# EAGLE design STM32F107RC.ETH (EAGLE 7.1.0)
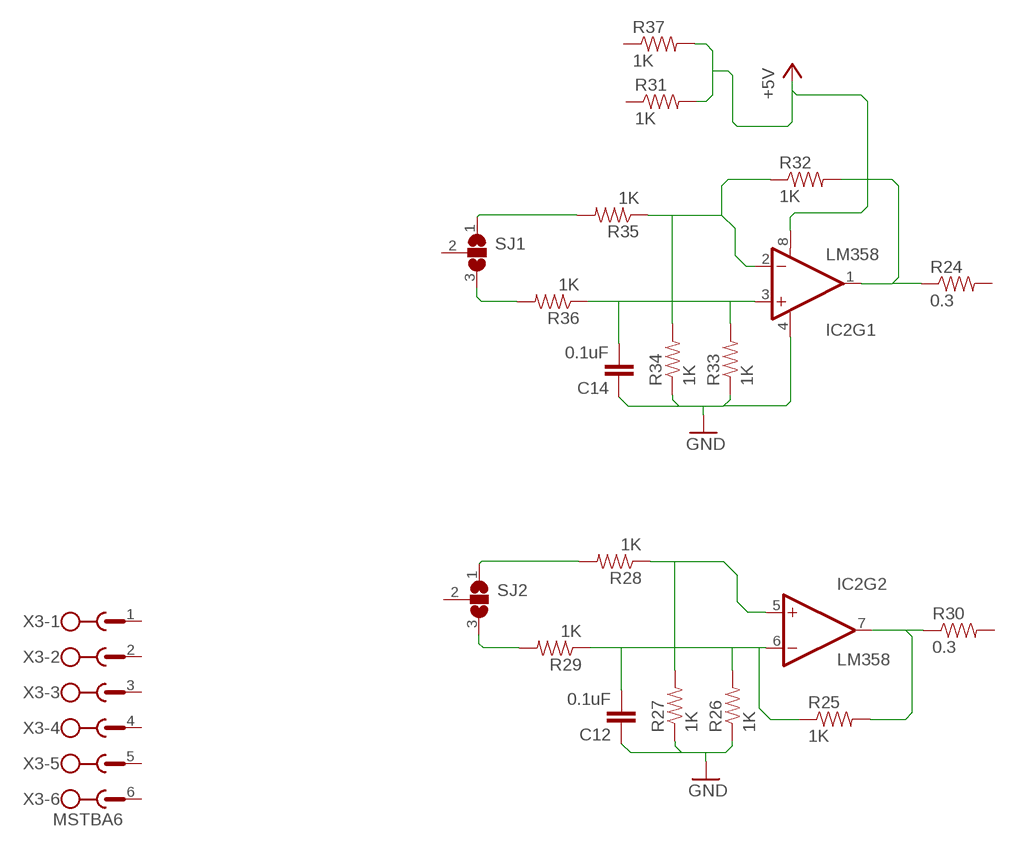
[diagram p0: schematic, sheet 1, part 1 of 2]
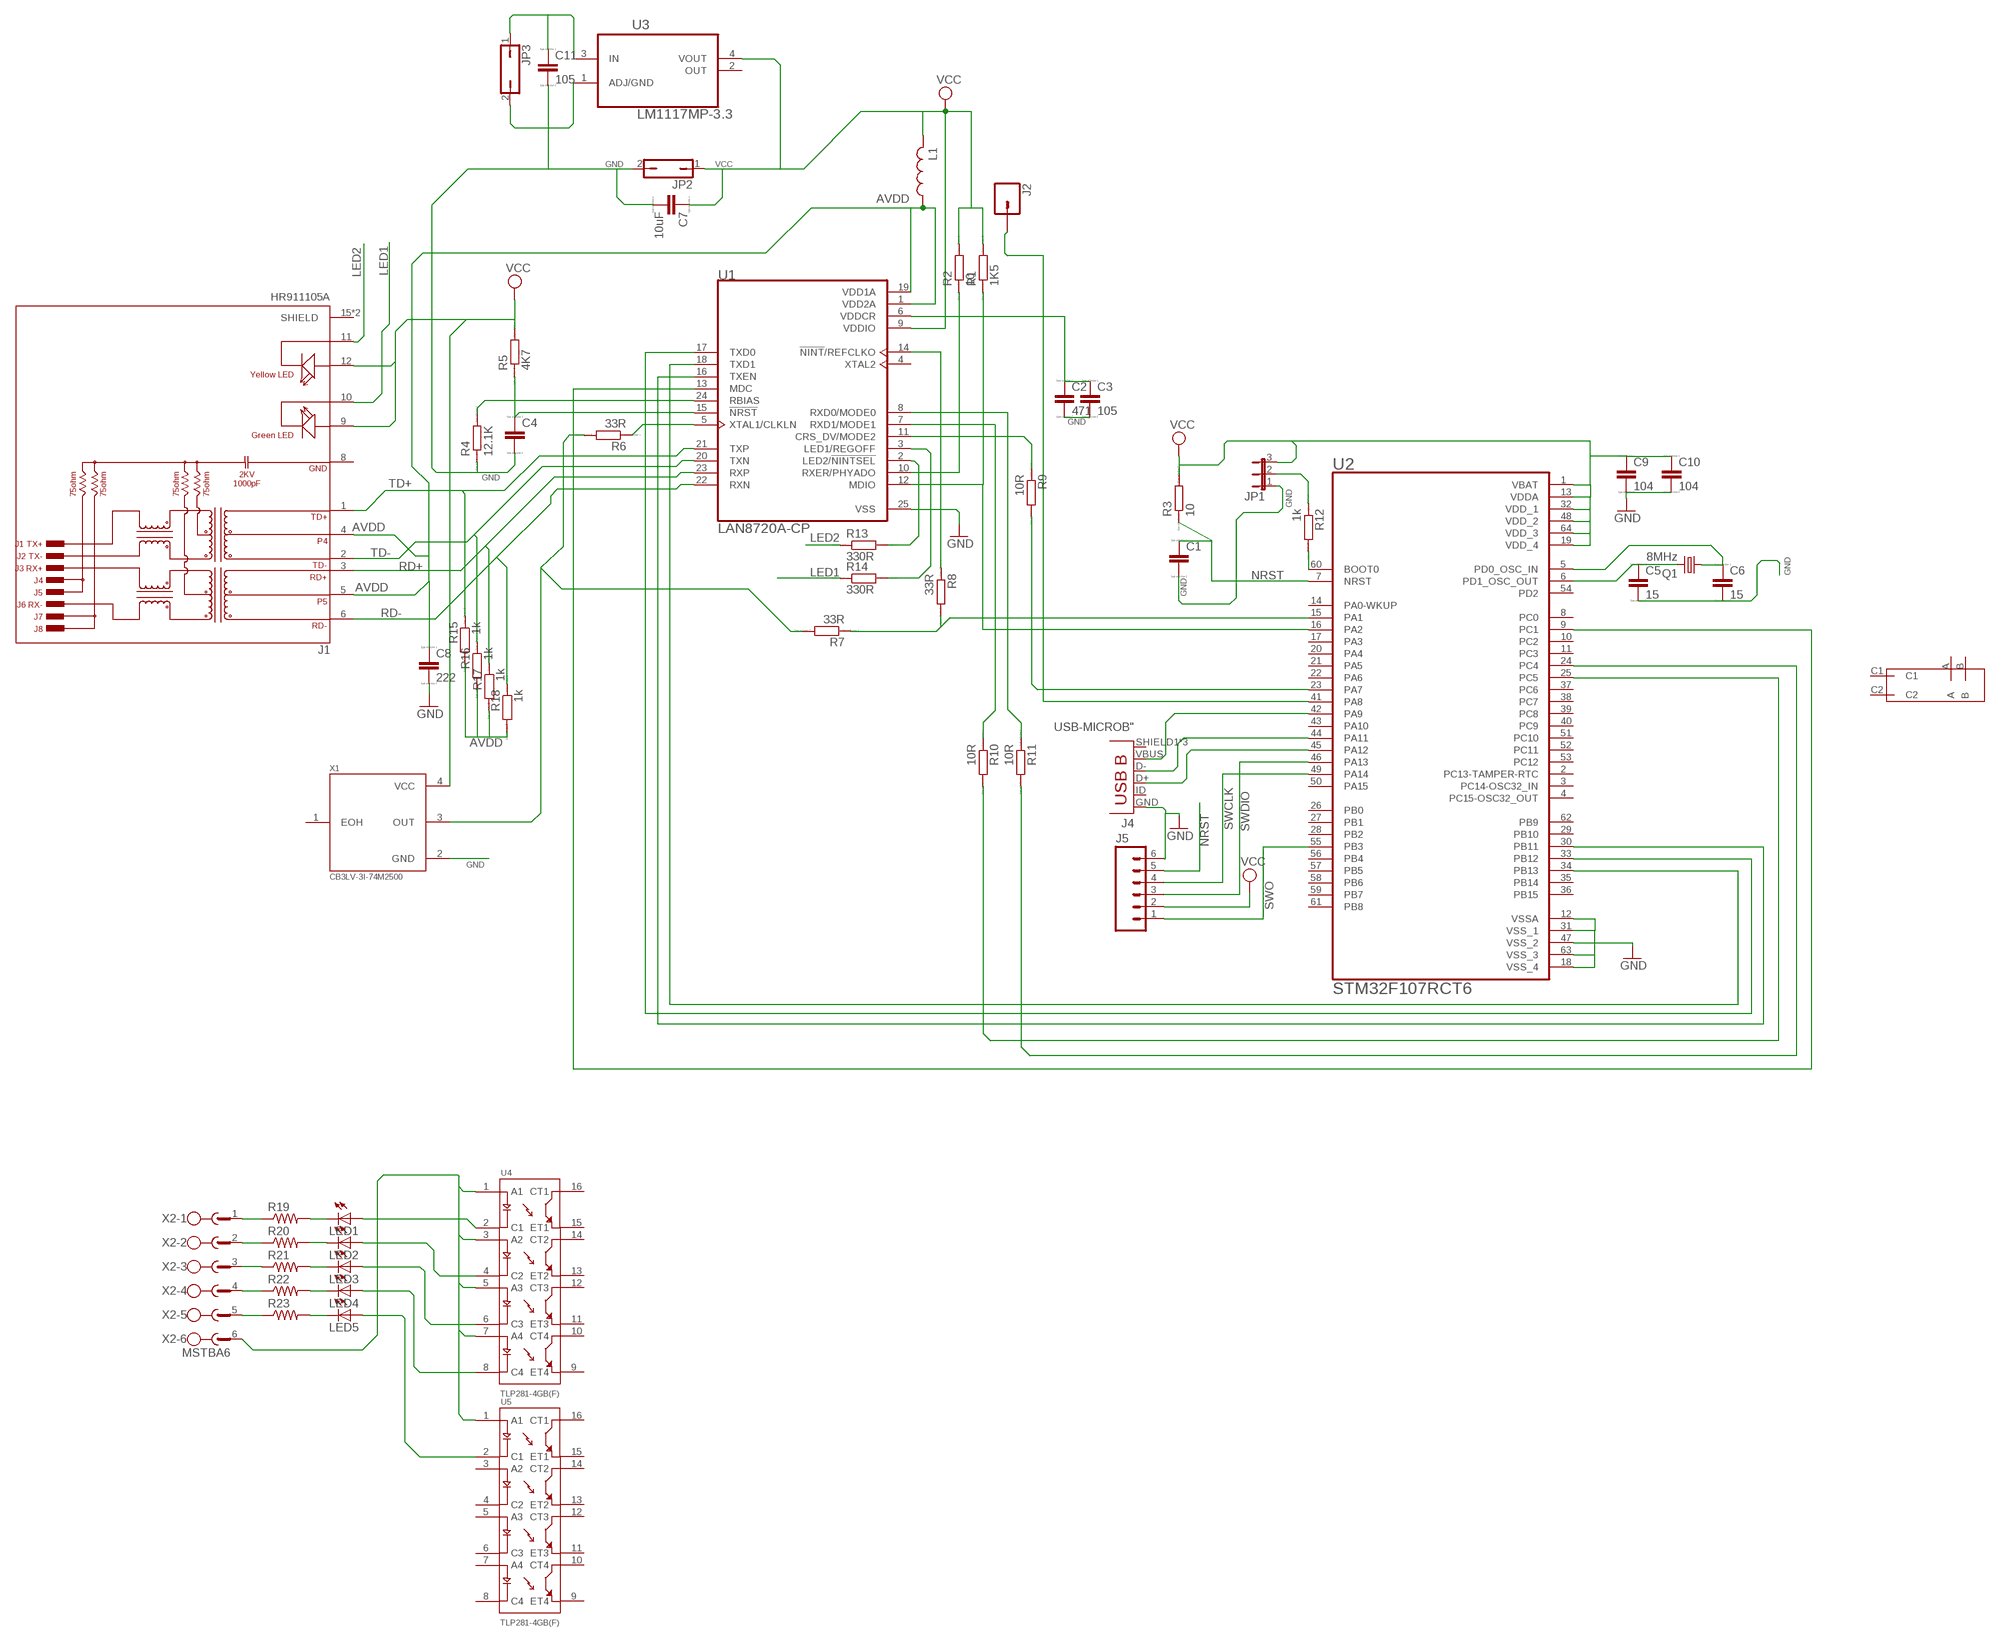
[diagram p1: schematic, sheet 1, part 2 of 2]

## Parts
C1  C-EUC1206  [C1206]
C2  471  C-EUC1206  [C1206]
C3  105  C-EUC1206  [C1206]
C4  C-EUC1206  [C1206]
C5  15  C-EUC1206  [C1206]
C6  15  C-EUC1206  [C1206]
C7  10uF  C-EUC1206  [C1206]
C8  222  C-EUC1206  [C1206]
C9  104  C-EUC1206  [C1206]
C10  104  C-EUC1206  [C1206]
C11  105  C-EUC1206  [C1206]
C12  0.1uF  0.1UF-25V-5%(0603)  [0603-CAP]
C14  0.1uF  0.1UF-25V-5%(0603)  [0603-CAP]
IC2  LM358  [LM358_DIP08]
J1  HR911105A  [HANRUN_HR911105A]
J2  M01OFFSET  [1X01_OFFSET]
J4  USB-MICROB"  [USB-B-MICRO-SMD_V03]
J5  M06POLAR  [MOLEX-1X6]
JP1  JP2E  [JP2]
JP2  JP1Q  [JP1]
JP3  JP1Q  [JP1]
L1  L-US0207/7  [0207/7]
LED1  LEDCHIPLED_0805  [CHIPLED_0805]
LED2  LEDCHIPLED_0805  [CHIPLED_0805]
LED3  LEDCHIPLED_0805  [CHIPLED_0805]
LED4  LEDCHIPLED_0805  [CHIPLED_0805]
LED5  LEDCHIPLED_0805  [CHIPLED_0805]
Q1  8MHz  CRYSTALHC49S  [HC49/S]
R1  1K5  R-EU_0204_7  [0204/7]
R2  10  R-EU_0204_7  [0204/7]
R3  10  R-EU_0204_7  [0204/7]
R4  12.1K  R-EU_0204_7  [0204/7]
R5  4K7  R-EU_0204_7  [0204/7]
R6  33R  R-EU_0204_7  [0204/7]
R7  33R  R-EU_0204_7  [0204/7]
R8  33R  R-EU_0204_7  [0204/7]
R9  10R  R-EU_0204_7  [0204/7]
R10  10R  R-EU_0204_7  [0204/7]
R11  10R  R-EU_0204_7  [0204/7]
R12  1k  R-EU_0204_7  [0204/7]
R13  330R  R-EU_0204_7  [0204/7]
R14  330R  R-EU_0204_7  [0204/7]
R15  1k  R-EU_0204_7  [0204/7]
R16  1k  R-EU_0204_7  [0204/7]
R17  1k  R-EU_0204_7  [0204/7]
R18  1k  R-EU_0204_7  [0204/7]
R19  RESISTOR0805-RES  [0805]
R20  RESISTOR0805-RES  [0805]
R21  RESISTOR0805-RES  [0805]
R22  RESISTOR0805-RES  [0805]
R23  RESISTOR0805-RES  [0805]
R24  0.3  0.3OHM-1/8W-1%(0805)  [0805]
R25  1K  1KOHM-1/4W-1%(PTH)  [AXIAL-0.3]
R26  1K  1KOHM-1/4W-1%(PTH)  [AXIAL-0.3]
R27  1K  1KOHM-1/4W-1%(PTH)  [AXIAL-0.3]
R28  1K  1KOHM-1/4W-1%(PTH)  [AXIAL-0.3]
R29  1K  1KOHM-1/4W-1%(PTH)  [AXIAL-0.3]
R30  0.3  0.3OHM-1/8W-1%(0805)  [0805]
R31  1K  1KOHM-1/4W-1%(PTH)  [AXIAL-0.3]
R32  1K  1KOHM-1/4W-1%(PTH)  [AXIAL-0.3]
R33  1K  1KOHM-1/4W-1%(PTH)  [AXIAL-0.3]
R34  1K  1KOHM-1/4W-1%(PTH)  [AXIAL-0.3]
R35  1K  1KOHM-1/4W-1%(PTH)  [AXIAL-0.3]
R36  1K  1KOHM-1/4W-1%(PTH)  [AXIAL-0.3]
R37  1K  1KOHM-1/4W-1%(PTH)  [AXIAL-0.3]
SJ1  SJ2W  [SJ_2]
SJ2  SJ2W  [SJ_2]
U1  LAN8720A-CP  [QFN50P400X400X100-25N]
U2  STM32F107RCT6  [QFP50P1200X1200X160-64N]
U3  LM1117MP-3.3  [SOT230P696X180-4N]
U4  TLP281-4GB(F)  [SOIC127P700X210-16N]
U5  TLP281-4GB(F)  [SOIC127P700X210-16N]
U$1  OMRON-RELAY-G5NB  [OMRON-G5NB]
X1  CB3LV-3I-74M2500  [OSCCC700X500X180-4N]
X2  MSTBA6  [MSTBA6]
X3  MSTBA6  [MSTBA6]

## Nets
+5V: IC2.8(V+) R31.P$2 R37.P$2
AVDD: C8.1 J1.4 J1.5 L1.1 R15.2 R16.2 R17.2 R18.2 U1.1(VDD2A) U1.19(VDD1A)
GND: C1.2 C2.2 C3.2 C4.2 C5.2 C6.2 C7.2 C8.2 C9.2 C10.2 C11.2 C12.1 C14.1 IC2.4(V-) J4.GND J5.6 JP1.1 JP2.2 JP3.2 R4.1 R26.P$1 R27.P$1 R33.P$1 R34.P$1 U1.25(VSS) U2.12(VSSA) U2.18(VSS_4) U2.31(VSS_1) U2.47(VSS_2) U2.63(VSS_3) U3.1(ADJ/GND) X1.2(GND)
LED1: J1.10(GC) R14.1
LED2: J1.11(YC) R13.1
N$1: R1.1 U1.12(MDIO) U2.16(PA2)
N$2: U1.13(MDC) U2.9(PC1)
N$3: R7.1 R8.2 U2.15(PA1)
N$4: R9.2 U2.23(PA7)
N$5: R11.2 U2.24(PC4)
N$6: J4.VBUS U2.42(PA9)
N$7: U1.16(TXEN) U2.30(PB11)
N$8: U1.17(TXD0) U2.33(PB12)
N$9: U1.18(TXD1) U2.34(PB13)
N$10: J2.1 U2.41(PA8)
N$11: J4.D- U2.44(PA11)
N$12: R2.1 U1.10(RXER/PHYADO)
N$13: R4.2 U1.24(RBIAS)
N$14: C2.1 C3.1 U1.6(VDDCR)
N$15: R10.2 U2.25(PC5)
N$16: C4.1 R5.1 U1.15(!NRST)
N$17: R6.1 U1.5(XTAL1/CLKLN)
N$18: R6.2 R7.2 X1.3(OUT)
N$19: R8.1 U1.14(!NINT!/REFCLKO)
N$20: R9.1 U1.11(CRS_DV/MODE2)
N$21: R10.1 U1.7(RXD1/MODE1)
N$22: R11.1 U1.8(RXD0/MODE0)
N$23: C11.1 JP3.1 U3.3(IN)
N$24: JP1.2 R12.1
N$25: R12.2 U2.60(BOOT0)
N$26: C6.1 Q1.1 U2.5(PD0_OSC_IN)
N$27: C5.1 Q1.2 U2.6(PD1_OSC_OUT)
N$28: J4.D+ U2.45(PA12)
N$29: R19.1 X2.1
N$30: R20.1 X2.2
N$31: R21.1 X2.3
N$32: LED1.C R19.2
N$33: LED2.C R20.2
N$34: LED3.C R21.2
N$35: LED1.A U4.2(C1)
N$36: LED2.A U4.4(C2)
N$37: LED3.A U4.6(C3)
N$38: U4.1(A1) U4.3(A2) U4.5(A3) U4.7(A4) U5.1(A1) X2.6
N$39: R22.1 X2.4
N$40: LED4.C R22.2
N$41: LED4.A U4.8(C4)
N$44: C12.2 IC2.6(-IN) R25.P$1 R26.P$2 R29.P$1
N$45: R23.1 X2.5
N$46: LED5.C R23.2
N$47: LED5.A U5.2(C1)
N$48: IC2.5(+IN) R27.P$2 R28.P$1
N$49: IC2.7(OUT) R25.P$2 R30.1
N$50: R28.P$2 SJ2.1
N$51: R29.P$2 SJ2.3
N$55: IC2.2(-IN) R32.P$1 R34.P$2 R35.P$1
N$56: C14.2 IC2.3(+IN) R33.P$2 R36.P$1
N$58: IC2.1(OUT) R24.1 R32.P$2
N$60: R35.P$2 SJ1.1
N$61: R36.P$2 SJ1.3
NRST: C1.1 J5.5 R3.1 U2.7(NRST)
RD+: J1.3(RD+) R17.1 U1.23(RXP)
RD-: J1.6(RD-) R18.1 U1.22(RXN)
SIG_LED01: R14.2 U1.3(LED1/REGOFF)
SIG_LED02: R13.2 U1.2(LED2/!NINTSEL!)
SWCLK: J5.4 U2.49(PA14)
SWDIO: J5.3 U2.46(PA13)
SWO: J5.1 U2.55(PB3)
TD+: J1.1(TD+) R15.1 U1.21(TXP)
TD-: J1.2(TD-) R16.1 U1.20(TXN)
VCC: C7.1 C9.1 C10.1 J1.9(GA) J1.12(YA) J5.2 JP1.3 JP2.1 L1.2 R1.2 R2.2 R3.2 R5.2 U1.9(VDDIO) U2.1(VBAT) U2.13(VDDA) U2.19(VDD_4) U2.32(VDD_1) U2.48(VDD_2) U2.64(VDD_3) U3.4(VOUT) X1.4(VCC)
Unconnected: J1.15(SHIELD) J1.16(SHIELD) J4.ID(USBID) J4.SHIELD1(SHIELD) J4.SHIELD2(SHIELD) J4.SHIELD3(SHIELD) R24.2 R30.2 R31.P$1 R37.P$1 SJ1.2 SJ2.2 U1.4(XTAL2) U2.2(PC13-TAMPER-RTC) U2.3(PC14-OSC32_IN) U2.4(PC15-OSC32_OUT) U2.8(PC0) U2.10(PC2) U2.11(PC3) U2.14(PA0-WKUP) U2.17(PA3) U2.20(PA4) U2.21(PA5) U2.22(PA6) U2.26(PB0) U2.27(PB1) U2.28(PB2) U2.29(PB10) U2.35(PB14) U2.36(PB15) U2.37(PC6) U2.38(PC7) U2.39(PC8) U2.40(PC9) U2.43(PA10) U2.50(PA15) U2.51(PC10) U2.52(PC11) U2.53(PC12) U2.54(PD2) U2.56(PB4) U2.57(PB5) U2.58(PB6) U2.59(PB7) U2.61(PB8) U2.62(PB9) U3.2(OUT) U4.9(ET4) U4.10(CT4) U4.11(ET3) U4.12(CT3) U4.13(ET2) U4.14(CT2) U4.15(ET1) U4.16(CT1) U5.3(A2) U5.4(C2) U5.5(A3) U5.6(C3) U5.7(A4) U5.8(C4) U5.9(ET4) U5.10(CT4) U5.11(ET3) U5.12(CT3) U5.13(ET2) U5.14(CT2) U5.15(ET1) U5.16(CT1) U$1.A U$1.B U$1.C1 U$1.C2 X1.1(EOH) X3.1 X3.2 X3.3 X3.4 X3.5 X3.6

## Power pins joined to a net without a drawn wire
GND: J1.8(GND)

## Library data of the parts
C1-C11 = resistor:C-EU: CAPACITOR, European symbol; SPICEPREFIX: C
C12 C14 = SparkFun-Capacitors:0.1UF-25V-5%(0603): CAP-08604; PROD_ID: CAP-08604
IC2 = SparkFun-AnalogIC:LM358: Jellybean op-amp
J1 = HR911105A:HR911105A: DIP RJ45 Connector;; AVAILABILITY: Unavailable; DESCRIPTION: DIP RJ45 Connector;; MF: HanRun; MP: HR911105A; PACKAGE: None; PRICE: None
J2 = SparkFun-Connectors:M01: Header 1 Standard 1-pin 0.1" header. Use with straight break away headers (SKU : PRT-00116), right angle break away headers (PRT-00553), swiss pins (PRT-00743), machine pins (PRT-00117), and female headers (PRT-00115). SMTSO-256-ET is a "flush mount" nut for a 4-40 screw. The older package used to be too tight, and did not allow it to sit properly thru the drill hit. The latest (0.165DIA) fits nice and snug.
J4 = SparkFun-Connectors:USB-MICROB: RED_PASTE version has 70% paste area under D+ D- USBID pins for applications where those pins aren't required, to reduce the likelihood of bridges.; PROD_ID: CONN-11752
J5 = SparkFun-Connectors:M06: Header 6 Standard 6-pin 0.1" header. Use with straight break away headers (SKU : PRT-00116), right angle break away headers (PRT-00553), swiss pins (PRT-00743), machine pins (PRT-00117), and female headers (PRT-00115). Molex polarized connector foot print use with SKU : PRT-08094 with associated crimp pins and housings. NOTES ON THE VARIANTS LOCK and LOCK_LONGPADS... This footprint was designed to help hold the alignment of a through-hole component (i.e. 6-pin header) while soldering it into place. You may notice that each hole has been shifted either up or down by 0.005 of an inch from it's more standard position (which is a perfectly straight line). This slight alteration caused the pins (the squares in the middle) to touch the edges of the holes. Because they are alternating, it causes a "brace" to hold the component in place. 0.005 has proven to be the perfect amount of "off-center" position when using our standard breakaway headers. Although looks a little odd when you look at the bare footprint, once you have a header in there, the alteration is very hard to notice. Also,if you push a header all the way into place, it is covered up entirely on the bottom side. This idea of altering the position of holes to aid alignment will be further integrated into the Sparkfun Library for other footprints. It can help hold any component with 3 or more connection pins.
JP1 = jumper:JP2E: JUMPER
JP2 JP3 = jumper:JP1Q: JUMPER
L1 = resistor:L-US: INDUCTOR, American symbol
LED1-LED5 = led:LED: LED OSRAM: - CHIPLED LG R971, LG N971, LY N971, LG Q971, LY Q971, LO R971, LY R971 LH N974, LH R974 LS Q976, LO Q976, LY Q976 LO Q996 - Hyper CHIPLED LW Q18S LB Q993, LB Q99A, LB R99A - SideLED LS A670, LO A670, LY A670, LG A670, LP A670 LB A673, LV A673, LT A673, LW A673 LH A674 LY A675 LS A676, LA A676, LO A676, LY A676, LW A676 LS A679, LY A679, LG A679 - Hyper Micro SIDELED® LS Y876, LA Y876, LO Y876, LY Y876 LT Y87S - SmartLED LW L88C, LW L88S LB L89C, LB L89S, LG L890 LS L89K, LO L89K, LY L89K LS L896, LA L896, LO L896, LY L896 - TOPLED LS T670, LO T670, LY T670, LG T670, LP T670 LSG T670, LSP T670, LSY T670, LOP T670, LYG T670 LG T671, LOG T671, LSG T671 LB T673, LV T673, LT T673, LW T673 LH T674 LS T676, LA T676, LO T676, LY T676, LB T676, LH T676, LSB T676, LW T676 LB T67C, LV T67C, LT T67C, LS T67K, LO T67K, LY T67K, LW E67C LS E67B, LA E67B, LO E67B, LY E67B, LB E67C, LV E67C, LT E67C LW T67C LS T679, LY T679, LG T679 LS T770, LO T770, LY T770, LG T770, LP T770 LB T773, LV T773, LT T773, LW T773 LH T774 LS E675, LA E675, LY E675, LS T675 LS T776, LA T776, LO T776, LY T776, LB T776 LHGB T686 LT T68C, LB T68C - Hyper Mini TOPLED® LB M676 - Mini TOPLED Santana® LG M470 LS M47K, LO M47K, LY M47K Source: http://www.osram.convergy.de LUXEON: - LUMILED® LXK2-PW12-R00, LXK2-PW12-S00, LXK2-PW14-U00, LXK2-PW14-V00 LXK2-PM12-R00, LXK2-PM12-S00, LXK2-PM14-U00 LXK2-PE12-Q00, LXK2-PE12-R00, LXK2-PE12-S00, LXK2-PE14-T00, LXK2-PE14-U00 LXK2-PB12-K00, LXK2-PB12-L00, LXK2-PB12-M00, LXK2-PB14-N00, LXK2-PB14-P00, LXK2-PB14-Q00 LXK2-PR12-L00, LXK2-PR12-M00, LXK2-PR14-Q00, LXK2-PR14-R00 LXK2-PD12-Q00, LXK2-PD12-R00, LXK2-PD12-S00 LXK2-PH12-R00, LXK2-PH12-S00 LXK2-PL12-P00, LXK2-PL12-Q00, LXK2-PL12-R00 Source: www.luxeon.com KINGBRIGHT: KA-3528ASYC Source: www.kingbright.com
Q1 = crystal:CRYSTAL: CRYSTAL; OC_FARNELL: 1667008; OC_NEWARK: unknown
R1-R18 = resistor:R-EU_: RESISTOR, European symbol; SPICEPREFIX: R
R19-R23 = SparkFun-Resistors:RESISTOR: Resistor Basic schematic elements and footprints for 0603, 1206, and PTH resistors.
R24 R30 = SparkFun-Resistors:0.3OHM-1/8W-1%(0805): RES-11622; PROD_ID: RES-11622
R25-R29 R31-R37 = SparkFun-Resistors:1KOHM-1/4W-1%(PTH): RES-12182; PROD_ID: RES-12182
SJ1 SJ2 = jumper:SJ2W: SMD solder JUMPER
U1 = LAN8720A-CP:LAN8720A-CP: LAN8720A Series 3.3 V RMII 10/100 Ethernet Transceiver Surface Mount - QFN-24; AVAILABILITY: Unavailable; DESCRIPTION: LAN8720A Series 3.3 V RMII 10/100 Ethernet Transceiver Surface Mount - QFN-24; MF: Microchip; MP: LAN8720A-CP; PACKAGE: QFN-24 Microchip; PRICE: None
U2 = STM32F107RCT6:STM32F107RCT6: ARM-based 32-bit MCU; AVAILABILITY: Unavailable; DESCRIPTION: MCU 32-bit STM32F1 ARM Cortex M3 RISC 256KB Flash 2.5V/3.3V 64-Pin LQFP Tray; MF: STMicroelectronics; MP: STM32F107RCT6; PACKAGE: LQFP-64 STMicroelectronics; PRICE: None
U3 = LM1117MP-3.3:LM1117MP-3.3: Linear regulators; AVAILABILITY: Unavailable; DESCRIPTION: LDO Regulator Pos 3.3V 0.8A 4-Pin_3+Tab_ SOT-223 T/R; MF: Texas Instruments; MP: LM1117MP-3.3; PACKAGE: SOT-223 Texas Instruments; PRICE: None
U4 U5 = TLP281-4GB_F_:TLP281-4GB(F): Optocoupler DC-IN 4-CH Transistor DC-OUT 16-Pin SOP; AVAILABILITY: Unavailable; DESCRIPTION: Optocoupler DC-IN 4-CH Transistor DC-OUT 16-Pin SOP; MF: Toshiba; MP: TLP281-4GB_F_; PACKAGE: SOP-16 Toshiba; PRICE: None
U$1 = omron-G5NB-1A-E:OMRON-RELAY-G5NB
X1 = CB3LV-3I-74M2500:CB3LV-3I-74M2500: Oscillator XO 50MHz 50ppm 50pF HCMOS/TTL 55% 3.3V 4-Pin SMD T/R; AVAILABILITY: Unavailable; DESCRIPTION: CB3LV Series 74.25 MHz 7 x 5 mm 3.3 V ±50 ppm SMT HCMOS/TTL Clock Oscillator; MF: CTS-Frequency; MP: CB3LV-3I-74M2500; PACKAGE: SMD-4 CTS Components; PRICE: None
X2 X3 = con-phoenix-508:MSTBA6: PHOENIX; MF: FARNELL; MPN: 1757284; OC_FARNELL: 3705213; OC_NEWARK: 71C4165

## Board
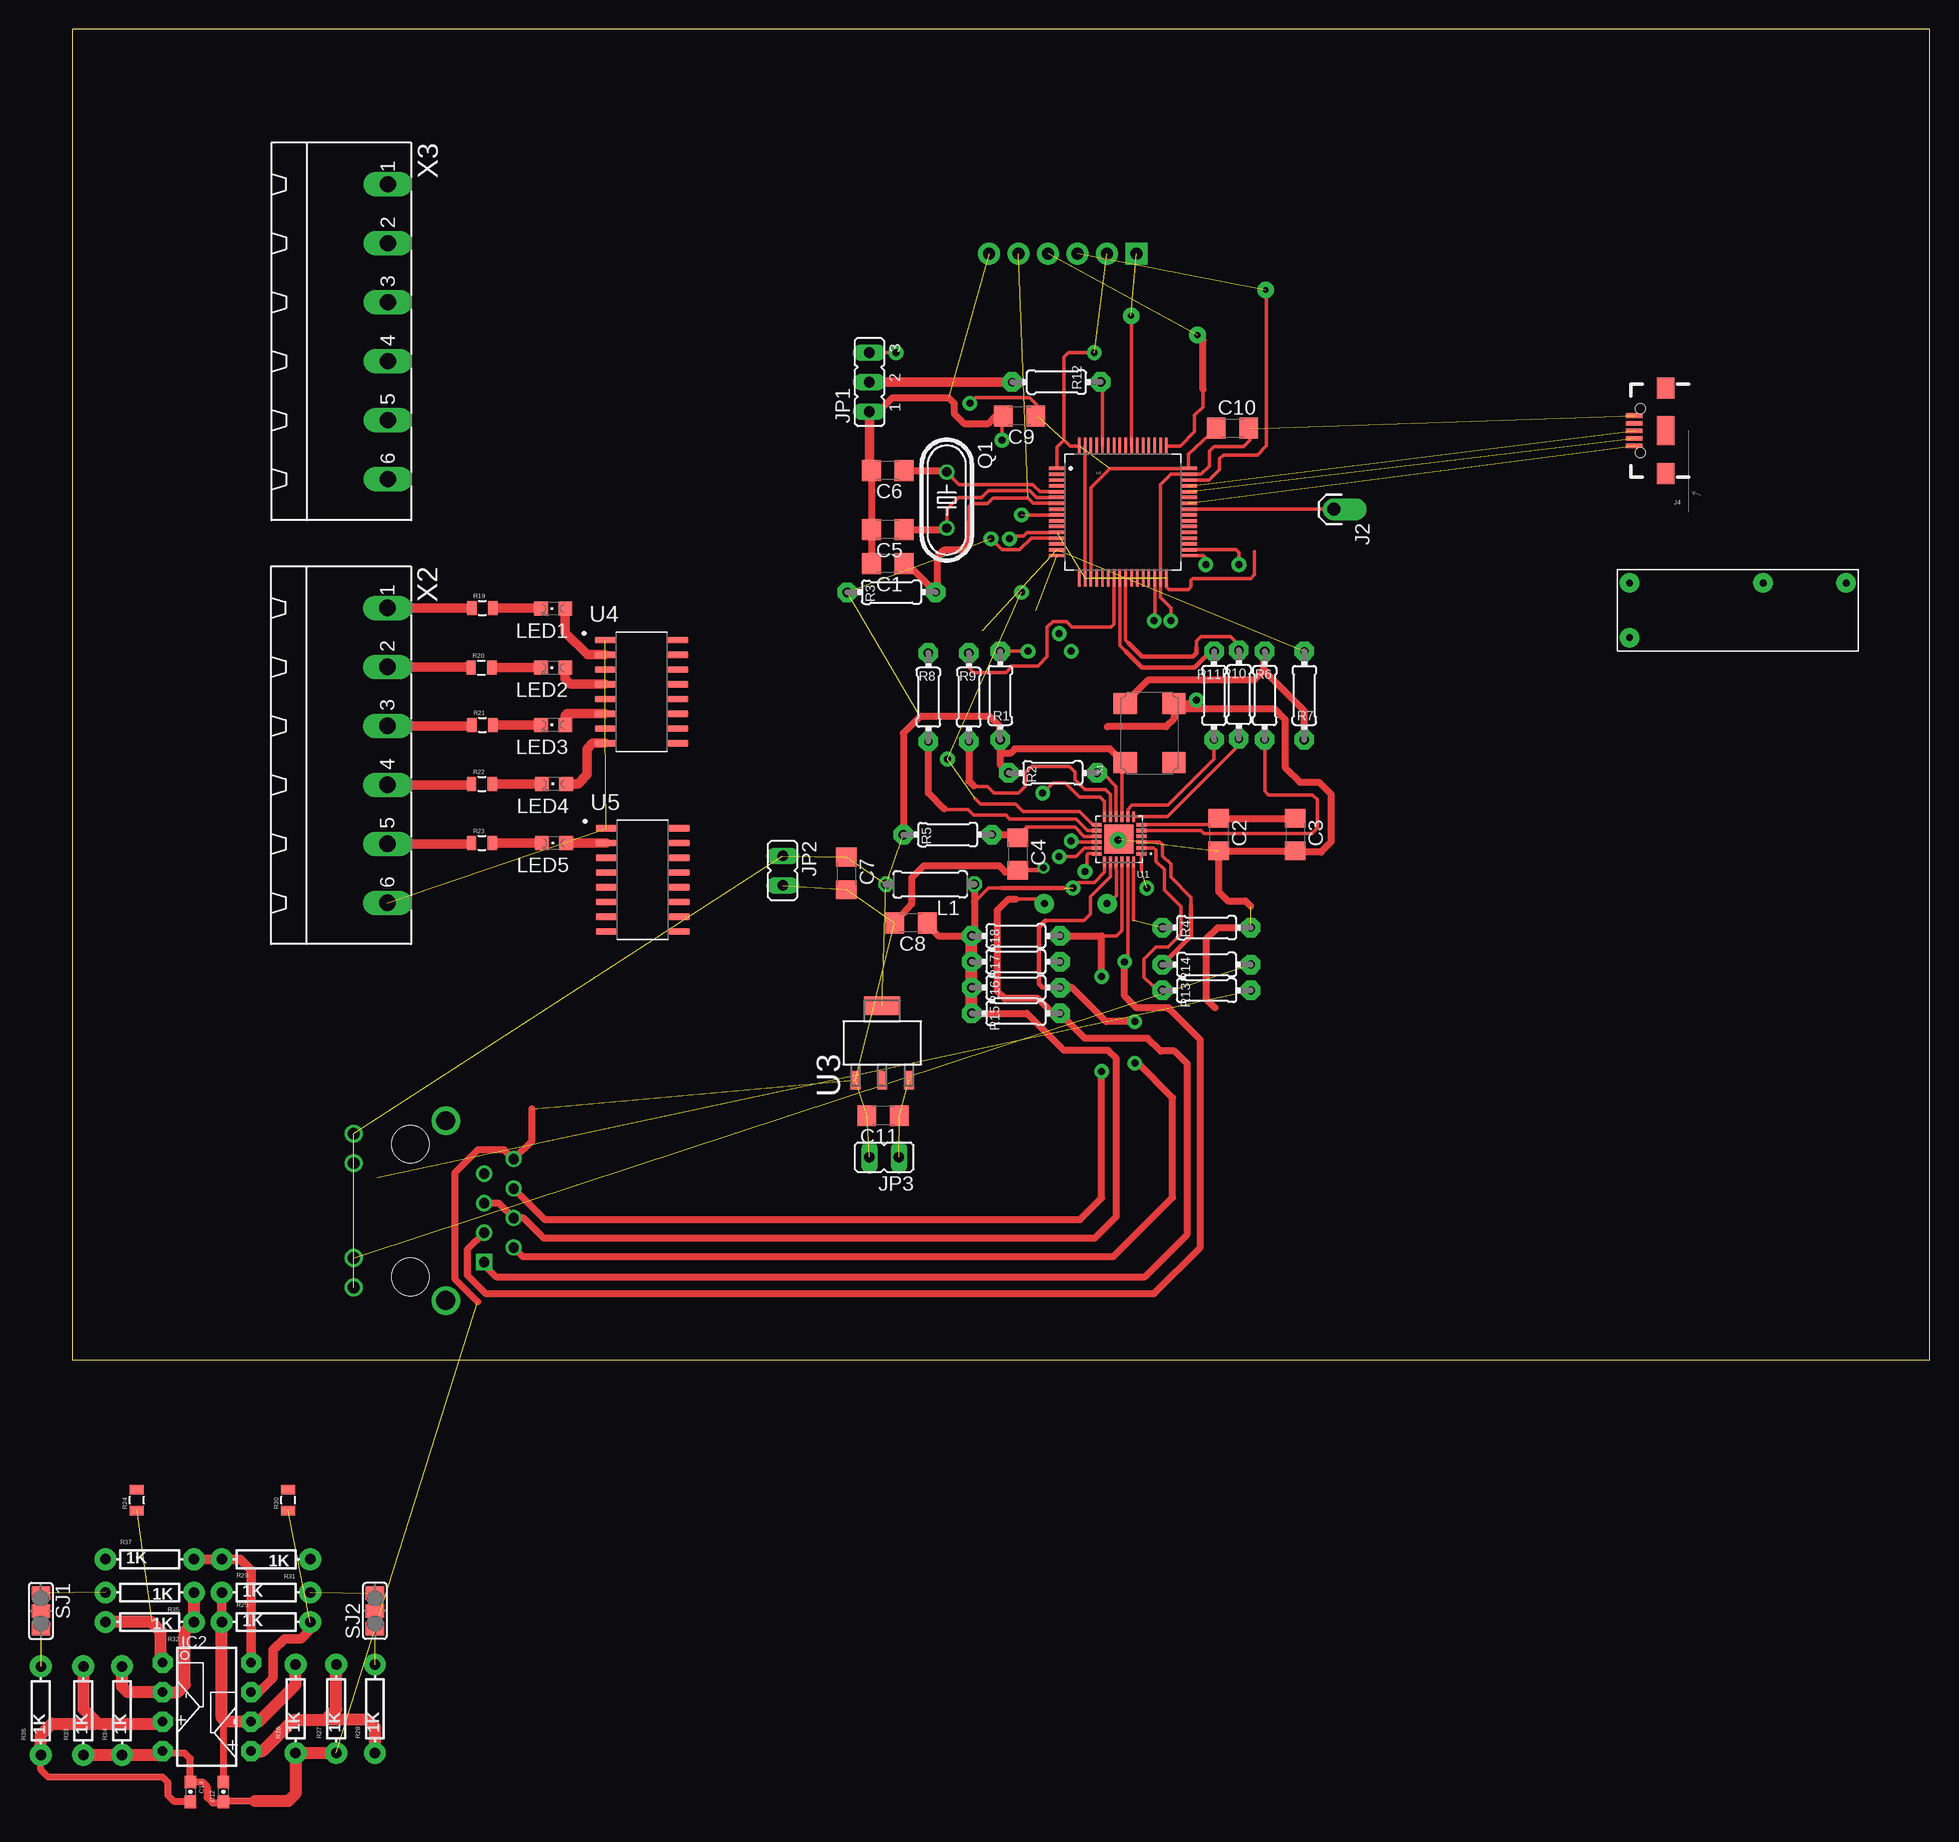
[diagram p2: board, top side]
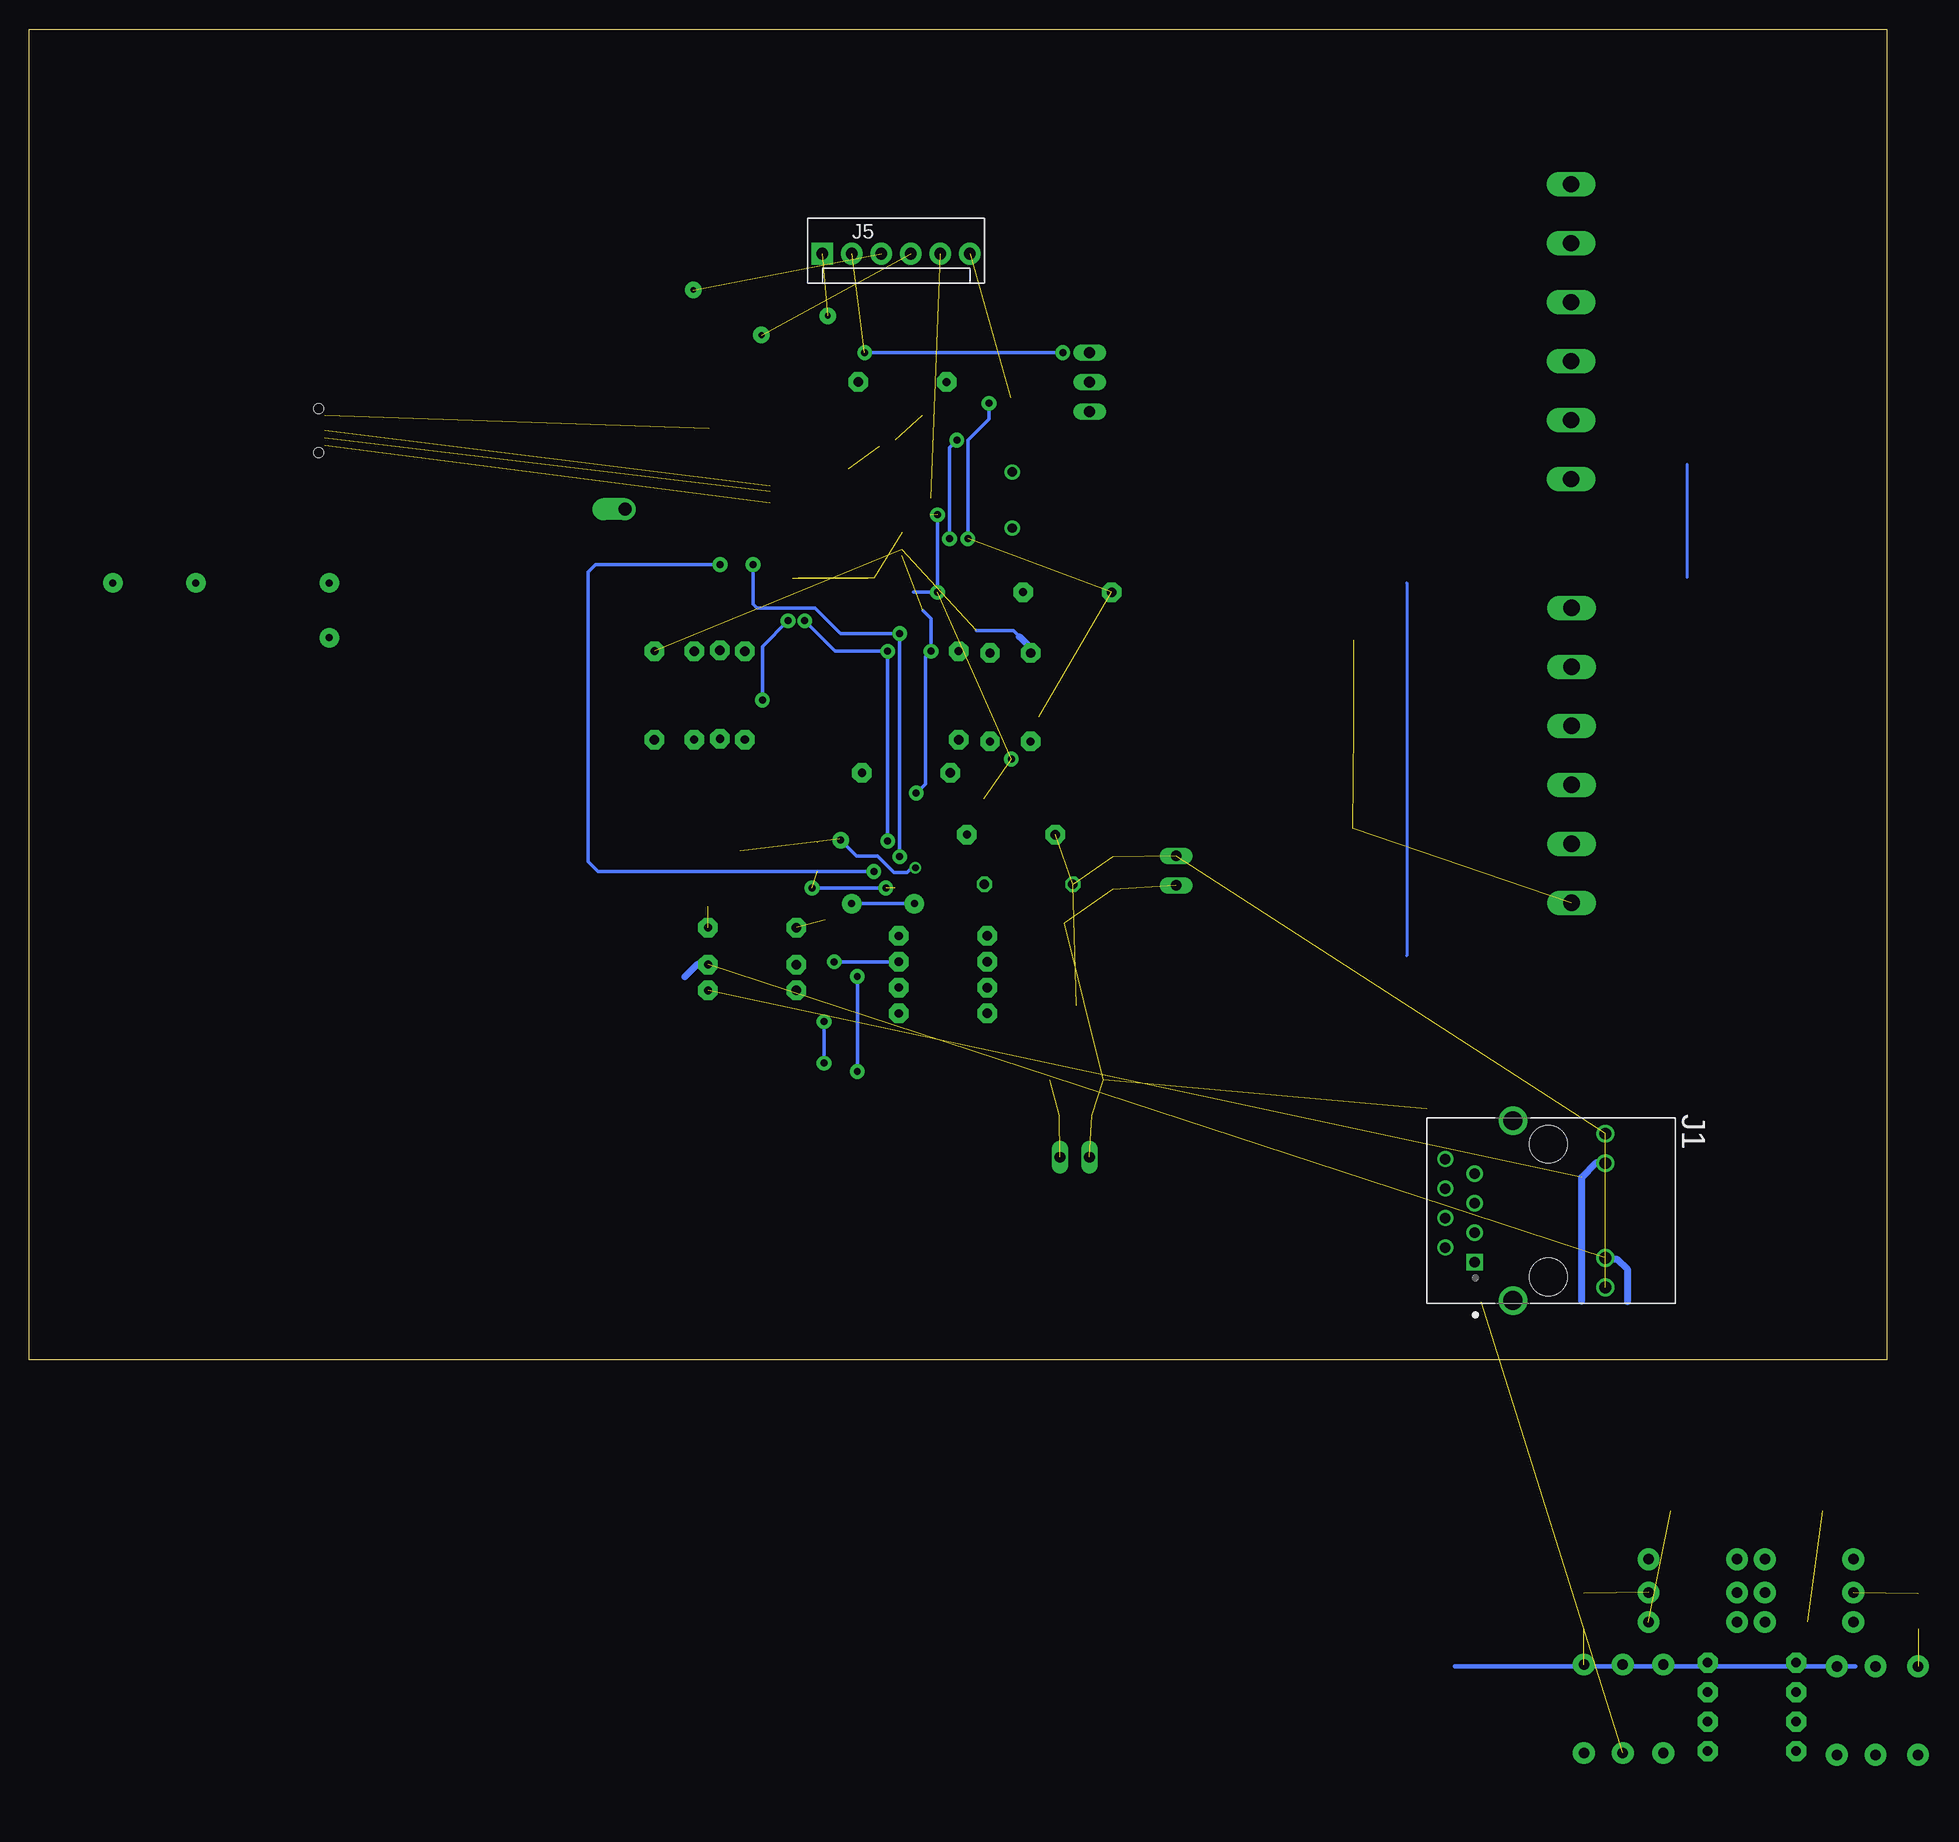
[diagram p3: board, bottom side, seen from below]

Size 160 x 114.63 mm. Coordinates in mm from the lower left corner, seen from the top.
Outline: 0,0 160,0 160,114.63 0,114.63 0,0
Copper layers (1*16): Top 0.035mm / dielectric 1.5mm / Bottom 0.035mm
Design rules "default": minimum track width 10mil, minimum drill 24mil, track to track 8mil, track to pad 8mil, pad to pad 8mil, via to via 8mil, smd to smd 8mil, copper to edge 40mil, drill to drill 8mil, minimum pad ring 10mil, minimum via ring 8mil, stop-mask expansion 4mil, vias tented up to drill 0mil, thermal gap 10mil

### Footprints (pad centres in the part's own frame; a part is rotated, then mirrored left to right if it is on the bottom)
C1206 = smd 1.6 x 1.8: 1 -1.4,0; 2 1.4,0
0603-CAP = smd 1.1 x 1: 1 -0.85,0; 2 0.85,0
LM358_DIP08 = drill 0.813 pad 1.727 octagon: 1 1.905,0; 2 4.445,0; 3 6.985,0; 4 9.525,0; 5 9.525,7.62; 6 6.985,7.62; 7 4.445,7.62; 8 1.905,7.62
HANRUN_HR911105A = drill 0.89 square: 1 4.45,-6.35 | drill 0.89: 2 3.18,-8.89; 3 1.91,-6.35; 4 0.64,-8.89; 5 -0.63,-6.35; 6 -1.9,-8.89; 7 -3.17,-6.35; 8 -4.44,-8.89 | drill 1.02: 9 6.625,4.9; 10 4.085,4.9; 11 -4.085,4.9; 12 -6.625,4.9 | drill 1.63: 15 7.745,-3.05; 16 -7.745,-3.05 | hole 3.25: -5.715,0; 5.715,0
1X01_OFFSET = drill 1.118 pad 1.88 offset: 1 0,0
USB-B-MICRO-SMD_V03 = smd 1.45 x 0.4: D+ 2.725,0; D- 2.725,0.65; GND 2.725,-1.3; ID 2.725,-0.65; VBUS 2.725,1.3 | smd 1.5 x 1.8: SHIELD1 0,3.685; SHIELD2 0,-3.685 | smd 1.5 x 2.5: SHIELD3 0,0 | hole 0.85: 2.2,1.9; 2.2,-1.9
MOLEX-1X6 = drill 1.016 pad 1.88 square: 1 0,0 | drill 1.016 pad 1.88: 2 2.54,0; 3 5.08,0; 4 7.62,0; 5 10.16,0; 6 12.7,0
JP2 = drill 0.914 long: 1 -2.54,0; 2 0,0; 3 2.54,0
JP1 = drill 0.914 long: 1 0,-1.27; 2 0,1.27
0207/7 = drill 0.813 octagon: 1 -3.81,0; 2 3.81,0
CHIPLED_0805 = smd 1.2 x 1.2: A 0,-1.05; C 0,1.05
HC49/S = drill 0.813: 1 -2.413,0; 2 2.413,0
0204/7 = drill 0.7 pad 1.676 octagon: 1 -3.81,0 | drill 0.813 pad 1.676 octagon: 2 3.81,0
0805 = smd 0.8 x 1.2: 1 -0.9,0; 2 0.9,0
AXIAL-0.3 = drill 0.9 pad 1.88: P$1 -3.81,0; P$2 3.81,0
SJ_2 = smd 1.168 x 1.6: 1 -1.524,0; 2 0,0; 3 1.524,0
QFN50P400X400X100-25N = smd 0.86 x 0.26: 1 -1.935,1.25; 2 -1.935,0.75; 3 -1.935,0.25; 4 -1.935,-0.25; 5 -1.935,-0.75; 6 -1.935,-1.25; 13 1.935,-1.25; 14 1.935,-0.75; 15 1.935,-0.25; 16 1.935,0.25; 17 1.935,0.75; 18 1.935,1.25 | smd 0.26 x 0.86: 7 -1.25,-1.935; 8 -0.75,-1.935; 9 -0.25,-1.935; 10 0.25,-1.935; 11 0.75,-1.935; 12 1.25,-1.935; 19 1.25,1.935; 20 0.75,1.935; 21 0.25,1.935; 22 -0.25,1.935; 23 -0.75,1.935; 24 -1.25,1.935 | smd 2.5 x 2.5: 25 0,0
QFP50P1200X1200X160-64N = smd 1.47 x 0.28: 1 -5.67,3.75; 2 -5.67,3.25; 3 -5.67,2.75; 4 -5.67,2.25; 5 -5.67,1.75; 6 -5.67,1.25; 7 -5.67,0.75; 8 -5.67,0.25; 9 -5.67,-0.25; 10 -5.67,-0.75; 11 -5.67,-1.25; 12 -5.67,-1.75; 13 -5.67,-2.25; 14 -5.67,-2.75; 15 -5.67,-3.25; 16 -5.67,-3.75; 33 5.67,-3.75; 34 5.67,-3.25; 35 5.67,-2.75; 36 5.67,-2.25; 37 5.67,-1.75; 38 5.67,-1.25; 39 5.67,-0.75; 40 5.67,-0.25; 41 5.67,0.25; 42 5.67,0.75; 43 5.67,1.25; 44 5.67,1.75; 45 5.67,2.25; 46 5.67,2.75; 47 5.67,3.25; 48 5.67,3.75 | smd 0.28 x 1.47: 17 -3.75,-5.67; 18 -3.25,-5.67; 19 -2.75,-5.67; 20 -2.25,-5.67; 21 -1.75,-5.67; 22 -1.25,-5.67; 23 -0.75,-5.67; 24 -0.25,-5.67; 25 0.25,-5.67; 26 0.75,-5.67; 27 1.25,-5.67; 28 1.75,-5.67; 29 2.25,-5.67; 30 2.75,-5.67; 31 3.25,-5.67; 32 3.75,-5.67; 49 3.75,5.67; 50 3.25,5.67; 51 2.75,5.67; 52 2.25,5.67; 53 1.75,5.67; 54 1.25,5.67; 55 0.75,5.67; 56 0.25,5.67; 57 -0.25,5.67; 58 -0.75,5.67; 59 -1.25,5.67; 60 -1.75,5.67; 61 -2.25,5.67; 62 -2.75,5.67; 63 -3.25,5.67; 64 -3.75,5.67
SOT230P696X180-4N = smd 1.6 x 0.838: 1 -3.2,2.311; 2 -3.2,0; 3 -3.2,-2.311 | smd 1.6 x 3.099: 4 3.2,0
SOIC127P700X210-16N = smd 1.8 x 0.59: 1 -3.155,4.445; 2 -3.155,3.175; 3 -3.155,1.905; 4 -3.155,0.635; 5 -3.155,-0.635; 6 -3.155,-1.905; 7 -3.155,-3.175; 8 -3.155,-4.445; 9 3.155,-4.445; 10 3.155,-3.175; 11 3.155,-1.905; 12 3.155,-0.635; 13 3.155,0.635; 14 3.155,1.905; 15 3.155,3.175; 16 3.155,4.445
OMRON-G5NB = drill 0.6 pad 1.676: A 12.55,5.85; B 19.7,5.85; C1 1.05,5.85; C2 1.05,1.15
OSCCC700X500X180-4N = smd 1.8 x 2: 1 -2.54,-2.1; 2 2.54,-2.1; 3 2.54,2.1; 4 -2.54,2.1
MSTBA6 = drill 1.397 long: 1 -12.7,5.08; 2 -7.62,5.08; 3 -2.54,5.08; 4 2.54,5.08; 5 7.62,5.08; 6 12.7,5.08

### Placement (x,y rotation side)
C1  70.25,68.58 180 top
C2  98.74,45.24 270 top
C3  105.33,45.24 270 top
C4  81.44,43.58 270 top
C5  70.25,71.52 180 top
C6  70.25,76.6 180 top
C7  66.67,41.91 270 top
C8  72.23,37.62 180 top
C9  81.6,81.28 180 top
C10  99.93,80.25 0 top
C11  69.85,21.03 180 top
C12  13.04,-37.21 90 top  (outside the outline)
C14  10.18,-37.21 270 top  (outside the outline)
IC2  7.79,-24.17 270 top  (outside the outline)
J1  29.13,12.86 270 bottom
J2  108.66,73.26 270 top
J4  137.25,80.02 180 top
J5  91.67,95.28 0 bottom
JP1  68.66,84.22 90 top
JP2  61.2,42.15 180 top
JP3  69.93,17.46 90 top
L1  73.9,40.96 180 top
LED1  41.43,64.7 90 top
LED2  41.43,59.62 90 top
LED3  41.43,54.7 90 top
LED4  41.5,49.61 90 top
LED5  41.5,44.52 90 top
Q1  75.33,74.06 270 top
R1  79.93,57.23 270 top
R2  84.45,50.56 180 top
R3  70.56,66.12 180 top
R4  97.71,37.23 180 top
R5  75.41,45.24 180 top
R6  102.71,57.23 90 top
R7  106.12,57.23 270 top
R8  73.74,57.07 90 top
R9  77.23,57.07 90 top
R10  100.49,57.31 90 top
R11  98.35,57.23 90 top
R12  84.77,84.22 0 top
R13  97.71,31.83 180 top
R14  97.71,34.05 180 top
R15  81.28,29.84 180 top
R16  81.28,32.07 180 top
R17  81.28,34.29 180 top
R18  81.28,36.51 180 top
R19  35.32,64.77 0 top
R20  35.25,59.62 0 top
R21  35.34,54.69 0 top
R22  35.3,49.61 0 top
R23  35.3,44.52 0 top
R24  5.57,-12.08 90 top  (outside the outline)
R25  16.7,-22.58 0 top  (outside the outline)
R26  19.24,-30.05 90 top  (outside the outline)
R27  22.74,-30.05 90 top  (outside the outline)
R28  26.08,-30.05 90 top  (outside the outline)
R29  16.7,-20.03 0 top  (outside the outline)
R30  18.6,-12.08 90 top  (outside the outline)
R31  16.7,-17.17 180 top  (outside the outline)
R32  6.68,-22.58 180 top  (outside the outline)
R33  0.95,-30.21 90 top  (outside the outline)
R34  4.29,-30.21 90 top  (outside the outline)
R35  6.68,-20.03 180 top  (outside the outline)
R36  -2.7,-30.21 90 top  (outside the outline)
R37  6.68,-17.17 0 top  (outside the outline)
SJ1  -2.7,-21.62 270 top  (outside the outline)
SJ2  26.08,-21.62 90 top  (outside the outline)
U1  90.17,44.85 180 top
U2  90.49,73.03 0 top
U3  69.77,27.3 90 top
U4  49.04,57.55 0 top
U5  49.13,41.34 0 top
U$1  133.09,61.06 0 top
X1  92.79,53.98 90 top
X2  22.06,52.07 270 top
X3  22.1,88.57 270 top

### Tracks (layer width: path | path; a pad name or v marks a point on that pad's centre or on a via)
+5V
  Top 0.813: IC2.8 15.41,-18.11 14.47,-17.17 R31.P$2 | R31.P$2 | R31.P$2 R37.P$2 | R37.P$2
AVDD  (via drill 0.6 pad 1.27)  (2 unrouted)
  Top 0.305: U1.1 92.11,42.12 | U1.19 88.92,42.01 88.03,41.12 86.68,41.12 v86.2,40.64 | 80.09,40.64 78.9,40.64 77.71,39.45
  Top 0.406: 85.41,40.64 80.09,40.64
  Top 0.61: R15.2 82.23,29.84 85.41,26.67 89.22,26.67 89.93,25.96 89.93,12.34 88.09,10.49 40.62,10.49 38.9,12.22 J1.4 36.75,13.49 J1.5 | C8.1 73.79,37.34 74.61,36.51 R18.2 77.71,36.75 77.71,39.45 L1.1
  Top 1.016: R15.2 R16.2 R17.2 R18.2
  Bottom 0.305: v92.55,40.64 v86.2,40.64
GND  (via drill 0.6 pad 1.02, 0.6 pad 1.27, 0.6 pad 1.42)  (13 unrouted)
  Top 0.305: U2.18 U2.63 | U2.12 82.23,71.28 81.92,70.96 80.96,70.96 v80.72,70.72 | v80.09,79.22 80.09,81.23 C9.2 | v94.61,63.66 94.61,64.77 93.74,65.65 U2.31 93.74,75.4 94.61,76.28 U2.47 97.23,76.28 97.95,76.99 97.95,78.26 98.35,78.66 100.89,78.66 101.44,79.22 101.44,80.2 C10.2
  Top 0.406: C4.2 83.45,42.18 v83.66,42.39 | 89.93,44.61 v90.09,44.77 U1.25
  Top 0.61: C6.2 C5.2 C1.2 | R4.1 98.66,37.23 97.71,36.27 97.71,31.04 98.42,30.32 | 101.52,39.05 101.04,39.53 99.54,39.53 98.74,40.32 C2.2 C3.2 105.38,43.74 107.55,43.74 108.43,44.61 108.43,48.74 107.39,49.77 105.73,49.77 104.46,51.04 104.46,55.17 103.58,56.04 95.37,56.04 X1.2 | C4.2 80.38,42.02 79.85,42.55 73.34,42.55 72.31,41.51 72.31,39.26 C8.2 | X1.2 94.89,55.2 94.22,54.53 89.14,54.53 | 34.92,5 32.94,6.99 32.94,16.11 34.92,18.1 37.22,18.1 J1.8 39.59,18.87 39.59,21.62 | JP1.1 69.45,81.68 70.64,82.87 75.49,82.87 75.96,82.39 75.96,81.52 76.86,80.61 78.87,80.61 79.45,81.2 79.96,81.2 C9.2 | X1.2 96.52,56.52 v96.84,56.83 | IC2.4 7.96,-33.87 9.7,-33.87 10.18,-34.34 C14.1 11.23,-36.36 11.61,-36.73 11.61,-37.68 12.08,-38.16 12.93,-38.16 C12.1 13.09,-38 15.74,-38
  Top 0.813: JP1.1 68.66,76.63 C6.2
  Top 1.016: R27.P$1 R26.P$1 19.24,-37.37 18.6,-38 15.74,-38 | R33.P$1 R34.P$1 | R34.P$1 | R34.P$1 7.46,-34.02 IC2.4
  Bottom 0.305: v83.66,42.39 83.98,42.39 84.38,41.99 85.49,41.99 86.92,43.42 88.74,43.42 v90.09,44.77 | v80.72,70.72 80.72,78.58 v80.09,79.22 | v96.84,56.83 96.84,61.44 v94.61,63.66
LED1  (1 unrouted)
  Bottom 0.61: R14.1 102.47,34.05 103.5,33.02 | 22.3,5 22.3,7.78 23.18,8.65 24.11,8.65 J1.10
LED2  (1 unrouted)
  Bottom 0.61: 26.27,5.08 26.27,15.72 25,16.99 24.27,16.99 J1.11
N$1  (via drill 0.6 pad 1.27)  (1 unrouted)
  Top 0.305: U1.12 88.92,48.08 88.5,48.5 86.76,48.5 85.57,49.69 84.46,49.69 v83.58,48.82 | v82.31,61.04 R1.1
  Bottom 0.305: 83,64.56 82.31,63.87 v82.31,61.04 82.79,60.56 82.79,49.61 v83.58,48.82
N$2  (via drill 0.6 pad 1.02, 0.6 pad 1.27)  (3 unrouted)
  Top 0.305: U1.13 87.89,46.1 86.76,47.23 81.88,47.23 81.25,47.86 78.23,47.86 77.75,48.34 | U2.9 82.38,72.78
  Bottom 0.305: 83.82,66.12 v81.76,66.12 v81.76,72.79
  other vias: 75.39,51.76
N$3  (2 unrouted)
  Bottom 0.305: 74.69,62.29 75.21,62.81 78.39,62.81
  Bottom 0.61: 74.69,62.29 73.74,61.34 R8.2
N$4
  Top 0.305: U2.23 89.74,63.38 89.46,63.1 86.12,63.1 85.65,63.58 84.45,63.58 83.98,63.1 83.98,60.56 83.19,59.77 80.96,59.77 80.41,59.21 77.63,59.21 77.23,59.61 R9.2
N$5
  Top 0.305: U2.24 90.24,61.53 90.73,61.04
  Top 0.406: 90.73,61.04 92.14,59.63 96.67,59.63 98.09,61.04 R11.2
N$6  (1 unrouted)
N$7  (via drill 0.6 pad 1.27)
  Top 0.305: U2.30 93.24,64.24 93.19,64.19 v93.19,63.66 | U1.16 86.21,44.6 v86.04,44.69
  Bottom 0.305: v86.04,44.69 v86.04,61.04 90.57,61.04 v93.19,63.66
N$8  (via drill 0.6 pad 1.27)
  Top 0.305: U2.33 97.41,69.28 97.63,69.06 v97.63,68.5 | U1.17 87.2,44.1 86.44,43.34 v85.01,43.34
  Bottom 0.305: v85.01,43.34 v85.01,62.55 90.09,62.55 92.31,64.77 97.31,64.77 97.63,65.09 v97.63,68.5
N$9  (via drill 0.6 pad 1.27)
  Top 0.305: U1.18 87.49,43.6 87.39,43.5 87.39,42.23 v87.23,42.07 | U2.34 100.25,69.78 100.49,69.53 v100.49,68.5
  Bottom 0.305: v100.49,68.5 111.2,68.5 111.84,67.87 111.84,42.94 110.97,42.07 v87.23,42.07
N$10
  Top 0.305: U2.41 108.65,73.28 J2.1
N$11  (1 unrouted)
N$12
  Top 0.305: U1.10 89.92,49.38 88.9,50.4 88.42,50.4 R2.1
N$13  (1 unrouted)
  Top 0.305: U1.24 91.42,37.88
N$14
  Top 0.305: U1.6 98.2,46.1 C2.1
  Top 0.61: C2.1 C3.1
N$15
  Top 0.305: U2.25 90.74,61.98 90.96,61.75 | R10.2 100.25,61.36 100.25,61.83 99.77,62.31 97.23,62.31 96.83,61.91 96.83,61.38
  Top 0.406: 90.96,61.75 92.14,60.58 96.52,60.58 96.83,60.9 96.83,61.38
N$16
  Top 0.305: 81.78,45.32 C4.1 | U1.15 87.14,45.1 86.36,45.88 82.18,45.88 C4.1 | 81.94,45.64 C4.1
  Top 0.61: R5.1 81.17,45.24 C4.1
N$17
  Top 0.305: U1.5 97.2,45.6 97.47,45.32 106.76,45.32 107.24,45.8 107.24,48.26 106.84,48.66 103.03,48.66 102.71,48.97 R6.1
N$18
  Top 0.61: X1.3 90.69,56.56 92.71,58.58 101.84,58.58 102.63,59.37 | 102.63,59.37 102.63,60.96 R6.2 | R7.2 106.12,55.88 102.63,59.37
N$19
  Top 0.305: U1.14 87.44,45.6 86.44,46.59 80.72,46.59 80.41,46.91 77.63,46.91 77.15,47.39 75.17,47.39 75.09,47.47
  Top 0.61: 75.09,47.47 73.74,48.82 R8.1
N$20
  Top 0.305: U1.11 89.42,48.69 88.98,49.13 87.23,49.13 86.36,50.01 86.36,50.64 85.88,51.12 82.63,51.12 82.07,50.56 82.07,49.37 81.52,48.82 79.38,48.82 78.82,49.37 77.71,49.37 77.63,49.45
  Top 0.61: R9.1 77.23,49.85 77.63,49.45
N$21
  Top 0.305: U1.7 94.33,46.78 100.41,52.86 100.41,53.42 R10.1
N$22
  Top 0.305: U1.8 90.92,47.42 91.28,47.78 94.38,47.78 98.35,51.75 R11.1
N$23  (2 unrouted)
N$24
  Top 0.813: R12.1 JP1.2
N$25
  Top 0.305: U2.60 88.74,84.06 R12.2
N$26
  Top 0.305: U2.5 83.34,74.78 82.71,75.41 76.39,75.41 Q1.1
  Top 0.61: C6.1 75.33,76.6 Q1.1
N$27
  Top 0.305: U2.6 83.05,74.28 82.47,74.85 78.9,74.85 78.32,74.28 76.34,74.28 75.33,73.26 Q1.2
  Top 0.61: C5.1 75.33,71.52 Q1.2
N$28  (1 unrouted)
N$29
  Top 0.813: X2.1 R19.1 | R19.1
N$30
  Top 0.813: X2.2 34.28,59.69 R20.1
N$31
  Top 0.813: X2.3 34.35,54.61 R21.1
N$32
  Top 0.813: R19.2 40.31,64.77 LED1.C
N$33
  Top 0.813: R20.2 LED2.C
N$34
  Top 0.813: R21.2 LED3.C
N$35
  Top 0.813: U4.2 44.37,60.73 42.45,62.65 42.45,64.68 LED1.A
N$36
  Top 0.813: U4.4 42.94,58.19 42.45,58.67 42.45,59.6 LED2.A
N$37
  Top 0.813: U4.6 42.61,55.65 42.45,55.49 42.45,54.72 LED3.A
N$38  (5 unrouted)
N$39
  Top 0.813: X2.4 34.32,49.53 R22.1
N$40
  Top 0.813: R22.2 LED4.C
N$41
  Top 0.813: U4.8 44.84,53.11 44.36,52.63 44.36,50.4 43.57,49.61 LED4.A
N$42
  Bottom 0.254: 17.17,67.42 17.17,77.12
N$43
  Bottom 0.254: 41.34,66.94 41.34,34.82
N$44
  Top 0.61: C12.2 13.04,-31.3 13.19,-31.15
  Top 0.813: 12.88,-22.59 12.88,-20.04 R29.P$1
  Top 1.016: R26.P$2 19.24,-27.98 16.07,-31.15 IC2.6 13.19,-31.15 12.88,-30.85 12.88,-22.59 R25.P$1
N$45
  Top 0.813: X2.5 34.33,44.45 R23.1
N$46
  Top 0.813: R23.2 LED5.C | LED5.C
N$47
  Top 0.813: U5.2 LED5.A
N$48
  Top 1.016: IC2.5 16.39,-33.69 19.08,-31.01 21.78,-31.01 | 21.78,-31.01 22.74,-30.05 R27.P$2 | R27.P$2 | R28.P$1 26.08,-31.64 25.44,-31.01 21.78,-31.01
N$49  (1 unrouted)
  Top 0.813: IC2.7 16.07,-28.61 17.17,-27.51 | 17.17,-27.51 | 17.17,-27.51 17.33,-27.35 17.33,-24.96 18.29,-24.01 19.72,-24.01 20.51,-23.21 R25.P$2
N$50  (1 unrouted)
N$51  (1 unrouted)
N$52
  Bottom 0.406: 2.7,-26.39 37.21,-26.39
N$55
  Top 1.016: R34.P$2 4.29,-28.14 4.76,-28.61 IC2.2 9.07,-28.61 9.7,-27.98 9.7,-23.37 R32.P$1 R35.P$1 | R34.P$2
N$56
  Top 0.61: C14.2 8.8,-38.06 8.27,-37.52 8.27,-36.41 7.79,-35.94 -2.07,-35.94 -2.7,-35.3 -2.7,-34.18 R36.P$1
  Top 1.016: R33.P$2 0.95,-30.05 2.15,-31.24 | 2.15,-31.24 2.23,-31.32 7.62,-31.32 IC2.3 | R36.P$1 -2.7,-32.28 -1.75,-31.32 2.07,-31.32 2.15,-31.24
N$58  (1 unrouted)
  Top 1.016: IC2.1 7.63,-26.24 7.63,-23.37 6.84,-22.58 R32.P$2 | R32.P$2
N$60  (1 unrouted)
N$61  (1 unrouted)
NRST  (1 unrouted)
  Top 0.305: 74.53,66.83 74.53,66.28 R3.1 | 77.23,71.99 77.23,73.5 77.47,73.74 78.82,73.74 79.3,74.22 82.31,74.22 82.75,73.78 U2.7
  Top 0.61: C1.1 71.91,68.58 R3.1 | 74.53,66.83 74.53,69.22 75.09,69.77 76.6,69.77 77.23,70.41 77.23,71.99
RD+  (via drill 0.6 pad 1.27)
  Top 0.305: U1.23 90.92,34.56 v90.65,34.29
  Top 0.61: v90.65,34.29 90.65,31.35 91.68,30.32 94.46,30.32 94.54,30.24 94.54,30.16 97.16,27.54 97.16,9.7 93.18,5.72 35.62,5.72 34.03,7.31 34.03,9.49 J1.3
  Bottom 0.305: v90.65,34.29 R17.1
RD-  (via drill 0.6 pad 1.27)
  Top 0.305: 88.66,36.51 89.93,36.51 90.41,36.99 90.41,41.55 U1.22 | 88.67,24.77 v88.66,24.84
  Top 0.61: R18.1 88.66,36.51 v88.66,33.02 | J1.6 40.7,12.08 86.82,12.08 88.66,13.93 v88.66,24.84
  Bottom 0.305: v88.66,24.84 v88.66,33.02
SIG_LED01  (1 unrouted)
  Top 0.305: U1.3 93.66,44.61 93.9,44.37 93.9,43.42 94.61,42.7 94.61,41.59 96.36,39.85 96.36,39.13
  Top 0.406: 96.36,39.13 96.36,36.51 R14.2
SIG_LED02
  Top 0.305: U1.2 93.14,44.1 93.34,43.89 93.34,42.94 94.06,42.23 94.06,40.48 95.49,39.05 95.49,36.67 94.38,35.56 93.34,35.56 92.31,34.53 92.31,32.94 93.03,32.23 93.5,32.23 R13.2
SWCLK  (via drill 0.5 pad 1.42)  (1 unrouted)
  Top 0.305: U2.49 95.44,78.69 96.68,79.93 96.68,81.36 97.39,82.07 97.39,83.58
  Top 0.61: 97.39,83.58 97.39,87.79 v96.92,88.27
SWDIO  (via drill 0.5 pad 1.42)  (1 unrouted)
  Top 0.305: U2.46 97.92,75.78 98.82,76.68 98.82,77.63 99.14,77.95 102.08,77.95 102.87,78.74 102.87,92.08 v102.79,92.15
SWO  (via drill 0.5 pad 1.42)  (1 unrouted)
  Top 0.305: U2.55 91.24,89.9 v91.2,89.93
TD+  (via drill 0.6 pad 1.68)
  Top 0.305: v89.14,39.29 89.61,39.69 89.93,40.01 89.93,41.55 U1.21 | 81.28,39.69 83.34,39.69 v83.74,39.29
  Top 0.61: 81.28,39.69 80.64,39.69 79.69,38.73 79.69,31.75 80.33,31.11 83.19,31.11 84.45,29.84 R15.1 87.23,27.7 92.63,27.7 93.74,26.59 94.93,26.59 96.04,25.48 96.04,10.82 92.38,7.16 36.5,7.16 35.48,8.18 J1.1
  Bottom 0.305: v83.74,39.29 v89.14,39.29
TD-  (via drill 0.6 pad 1.27)
  Top 0.305: 83.82,37.86 87.15,37.86 87.71,38.42 87.71,39.93 89.42,41.64 U1.20
  Top 0.406: R16.1 83.58,32.07 83.26,32.38 83.26,37.31 83.82,37.86
  Top 0.61: R16.1 86.12,32.07 89.06,29.13 v91.52,29.13 | J1.2 38.8,8.9 89.68,8.9 94.77,13.99 94.77,22.58 91.79,25.56 v91.52,25.56
  Bottom 0.305: v91.52,25.56 v91.52,29.13
VCC  (via drill 0.6 pad 1.27)  (12 unrouted)
  Top 0.305: 90.42,50.69 90.5,50.92 | 90.5,50.92 X1.4 | U1.9 90.42,50.69 | 90.42,50.69 90.42,50.84 90.5,50.92 | U2.19 87.74,75.12 89.4,76.78 U2.48 96.16,78.03 C10.1 | U2.32 94.24,66.58 94.46,66.36 96.12,66.36 96.36,66.6 96.36,67.15 96.52,67.31 101.52,67.31 101.84,67.63 101.84,69.61 | U2.64 85.93,78.69 85.41,79.22 | 85.41,79.22 85.41,86.36 85.8,86.76 v88.03,86.76 | v70.96,86.76 JP1.3 | U2.1 84.82,78.63 85.41,79.22 | U2.13 82.6,70.78 81.6,69.77 80.09,69.77 v79.14,70.72 | v77.31,82.39 77.79,82.87 82.47,82.87 83.11,82.23 83.11,81.33 C9.1
  Top 0.61: R5.2 71.6,53.98 73.03,55.4 79.06,55.4 79.93,54.53 R1.2 79.93,52.23 | 79.93,52.23 79.93,51.28 R2.2 | 90.42,50.69 90.42,51.58 89.38,52.63 81.2,52.63 80.8,52.23 79.93,52.23
  Bottom 0.305: v88.03,86.76 v70.96,86.76 | v79.14,70.72 79.14,79.22 77.31,81.04 v77.31,82.39